# EAGLE design untitled (EAGLE 9.6.2)
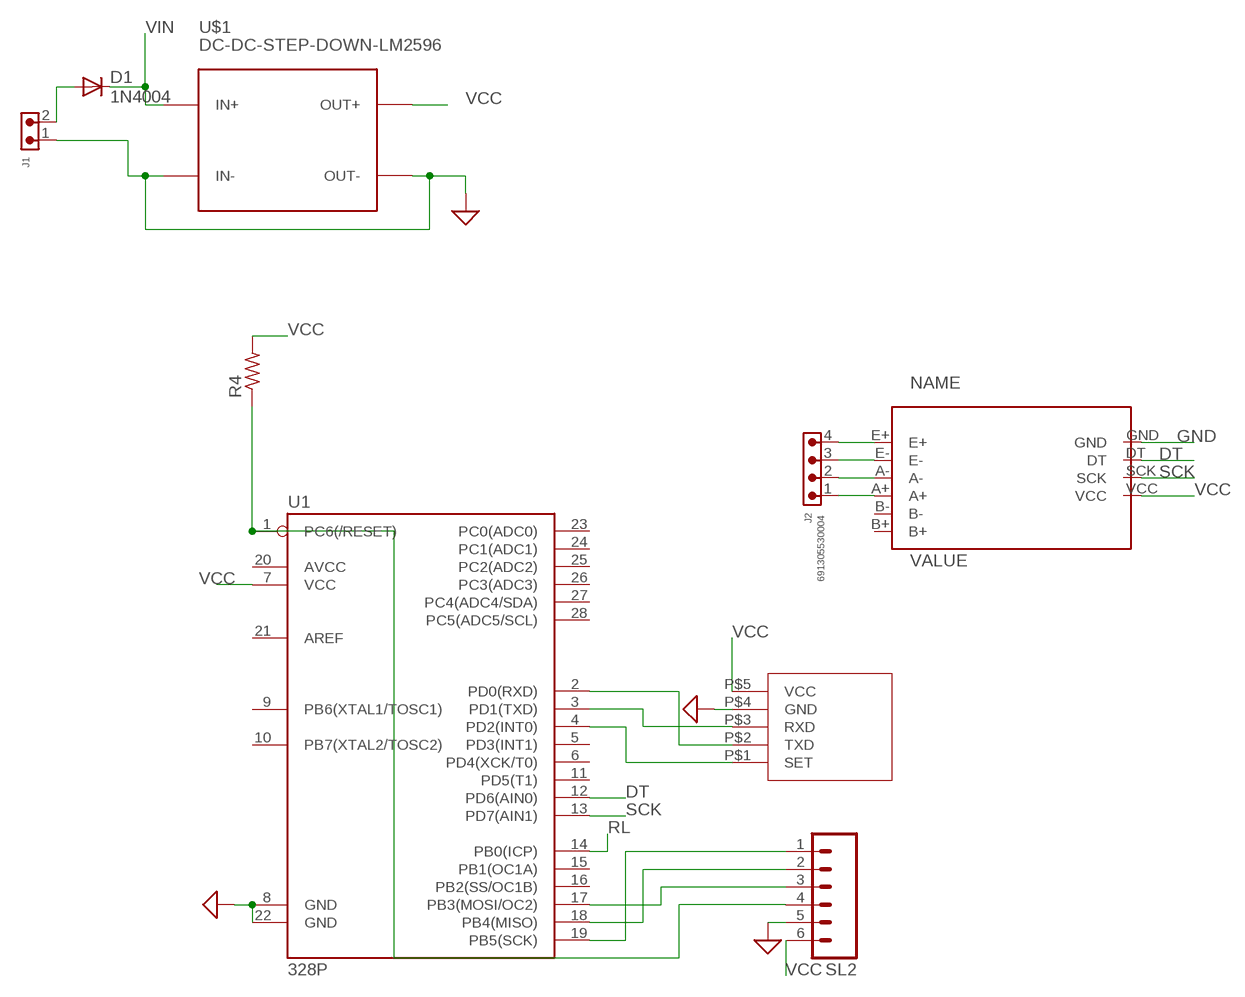
[diagram p0: schematic, sheet 1]

## Parts
D1  1N4004  [DO41-10]
J1  691305530002  691305530002  [691305530002]
J2  691305530004  691305530004  [691305530004]
R4  R-US_0207/7  [0207/7]
SL2  M06  [06P]
U1  328P  ATMEGA328P_PDIP  [DIP28]
U$1  DC-DC-STEP-DOWN-LM2596  [DC-DC-STEP-DOWN-LM2596]
U$2  HX711A  [HX711]
U$3  HC12  [HC12]

## Nets
DT: U1.12(PD6(AIN0)) U$2.DT
GND: J1.1 SL2.5 U1.8(GND) U1.22(GND) U$1.IN- U$1.OUT- U$2.GND U$3.P$4(GND) ; supply symbol labelled SUP
N$1: D1.A J1.2
N$2: J2.4 U$2.E+
N$3: U1.2(PD0(RXD)) U$3.P$2(TXD)
N$4: SL2.1 U1.19(PB5(SCK))
N$5: SL2.2 U1.18(PB4(MISO))
N$6: SL2.3 U1.17(PB3(MOSI/OC2))
N$7: U1.3(PD1(TXD)) U$3.P$3(RXD)
N$8: U1.4(PD2(INT0)) U$3.P$1(SET)
N$9: J2.3 U$2.E-
N$10: J2.2 U$2.A-
N$11: J2.1 U$2.A+
N$14: R4.1 SL2.4 U1.1(PC6(/RESET))
RL: U1.14(PB0(ICP))
SCK: U1.13(PD7(AIN1)) U$2.SCK
VCC: R4.2 SL2.6 U1.7(VCC) U$1.OUT+ U$2.VCC U$3.P$5(VCC)
VIN: D1.C U$1.IN+
Unconnected: U1.5(PD3(INT1)) U1.6(PD4(XCK/T0)) U1.9(PB6(XTAL1/TOSC1)) U1.10(PB7(XTAL2/TOSC2)) U1.11(PD5(T1)) U1.15(PB1(OC1A)) U1.16(PB2(SS/OC1B)) U1.20(AVCC) U1.21(AREF) U1.23(PC0(ADC0)) U1.24(PC1(ADC1)) U1.25(PC2(ADC2)) U1.26(PC3(ADC3)) U1.27(PC4(ADC4/SDA)) U1.28(PC5(ADC5/SCL)) U$2.B+ U$2.B-

## Library data of the parts
D1 = adafruit:1N4004: DIODE General purpose 1N400x type rectifier (With bigger pads) http://www.ladyada.net/library/pcb/eaglelibrary.html
J1 = Wurth_Connectors_WR-TBL Pluggable Connector:691305530002: WR-TBL Serie 3055 - 5,08 mm - PCB Header Vertical Entry with Plastic Latches KIND PROPERTIES Pitch 5.08 mm MATERIAL PROPERTIES Insulator Material PA66 Insulator Flammability Rating UL94 V-0 Insulator Color Green Terminal Material Copper Alloy Terminal Plating Tin-plated surface GENERAL INFORMATION Operating Temperature -40 up to +105 °C ELECTRICAL PROPERTIES IR UL 16 A Working Voltage [UL] 300 V (AC) Withstanding Voltage [UL] 2500 V (AC) Contact Resistance [UL] 20 mΩ CERTIFICATION UL Approval E315414 <https://www.we-online.com/catalog/media/o135349v209%20Family_WR-TBL3_6913055300xx.jpg> Details see: https://www.we-online.com/catalog/en/TBL_5_08_3055_6913055300XX/ Updated by Ella Wu 2019-12-30 2019(C) Wurth Elektronik; DATASHEET-URL: https://www.we-online.com/catalog/datasheet/691305530002.pdf; IR-UL: 16A; MOUNT: THT; PART-NUMBER: 691305530002; PINS: 2; PITCH: 5.08mm; TYPE: Vertical; WORKING-VOLTAGE-UL: 300V (AC)
J2 = Wurth_Connectors_WR-TBL Pluggable Connector:691305530004: WR-TBL Serie 3055 - 5,08 mm - PCB Header Vertical Entry with Plastic Latches KIND PROPERTIES Pitch 5.08 mm MATERIAL PROPERTIES Insulator Material PA66 Insulator Flammability Rating UL94 V-0 Insulator Color Green Terminal Material Copper Alloy Terminal Plating Tin-plated surface GENERAL INFORMATION Operating Temperature -40 up to +105 °C ELECTRICAL PROPERTIES IR UL 16 A Working Voltage [UL] 300 V (AC) Withstanding Voltage [UL] 2500 V (AC) Contact Resistance [UL] 20 mΩ CERTIFICATION UL Approval E315414 <https://www.we-online.com/catalog/media/o135349v209%20Family_WR-TBL3_6913055300xx.jpg> Details see: https://www.we-online.com/catalog/en/TBL_5_08_3055_6913055300XX/ Updated by Ella Wu 2019-12-30 2019(C) Wurth Elektronik; DATASHEET-URL: https://www.we-online.com/catalog/datasheet/691305530004.pdf; IR-UL: 16A; MOUNT: THT; PART-NUMBER: 691305530004; PINS: 4; PITCH: 5.08mm; TYPE: Vertical; WORKING-VOLTAGE-UL: 300V (AC)
R4 = adafruit:R-US_: RESISTOR, American symbol
SL2 = con-amp-quick:M06: AMP QUICK CONNECTOR; OC_FARNELL: unknown; OC_NEWARK: unknown
U1 = SparkFun-IC-Microcontroller:ATMEGA328P_PDIP: Atmel 328P Through hole ATMEGA328P uC used in the Arduino 32kb flash, 1k EEPROM, 2k SRAM Datasheet <http://www.sparkfun.com/datasheets/Components/SMD/ATMega328.pdf> SparkFun Products Storefront component: AVR 28 Pin 20MHz 32K 6A/D - ATMega328P <https://www.sparkfun.com/products/9061> (COM-09061) SparkFun Simon Says - Through-Hole Soldering Kit <https://www.sparkfun.com/products/10547> (KIT-10547) SparkFun Learn to Solder - Simon Says <https://www.sparkfun.com/products/13708> (KIT-13708) SparkFun BigTime Watch Kit <https://www.sparkfun.com/products/11734> (KIT-11734) SparkFun ClockIt <https://www.sparkfun.com/products/10930> (KIT-10930) SparkFun Serial Enabled LCD Kit <https://www.sparkfun.com/products/10097> (LCD-10097) SparkFun Simon Tilts - Through Hole Soldering Kit <https://www.sparkfun.com/products/12634> (KIT-12634) SparkFun Frequency Counter Kit <https://www.sparkfun.com/products/10140> (KIT-10140) FabFM Radio Kit <https://www.sparkfun.com/products/11043> (KIT-11043) SparkFun Binary Blaster Kit <https://www.sparkfun.com/products/12037> (KIT-12037) SparkFun Metro-Gnome <https://www.sparkfun.com/products/9236> (KIT-09236) ATmega328 with Arduino Optiboot (Uno) <https://www.sparkfun.com/products/10524> (DEV-10524); PROD_ID: IC-09136
U$1 = diy-modules:DC-DC-STEP-DOWN-LM2596: DC/DC Step-Down Regulator based on LM2596-ADJ chip LM2596 datasheet available here: http://www.ti.com/lit/ds/symlink/lm2596.pdf Click here to find device on ebay.com <http://www.ebay.com/sch/lm2596+power+regulator>
U$2 = HX711:HX711
U$3 = techart:HC12

## Board
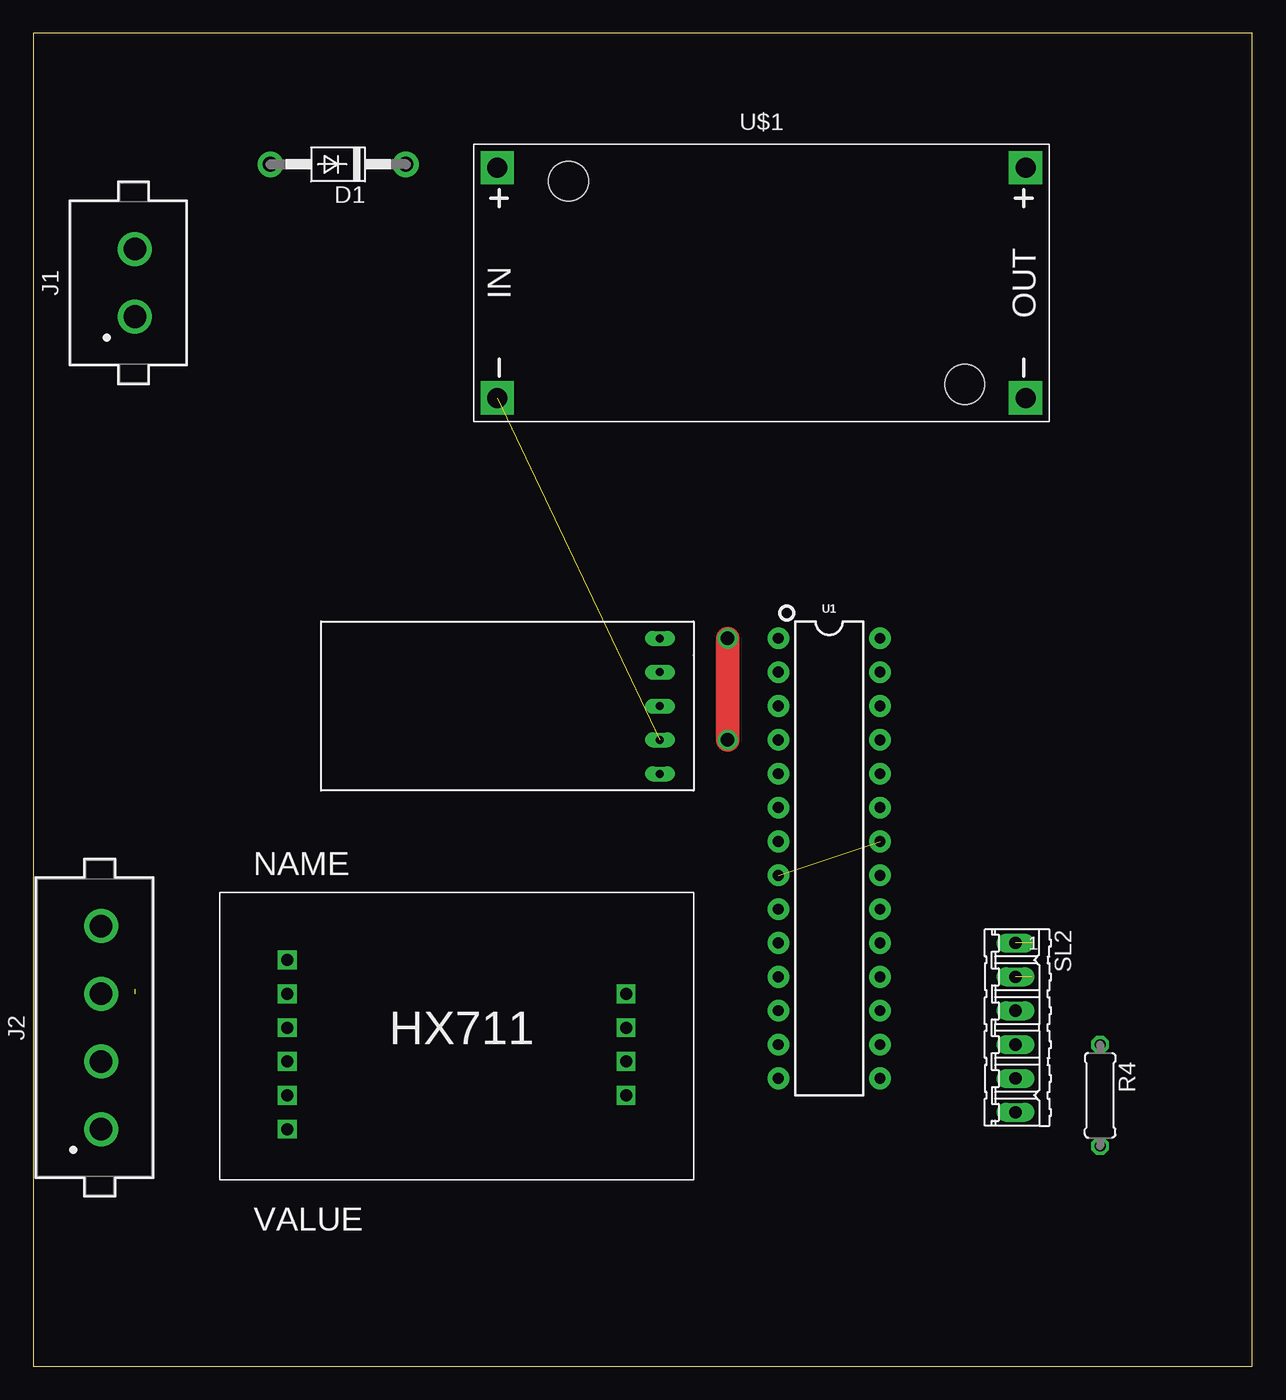
[diagram p1: board, top side]
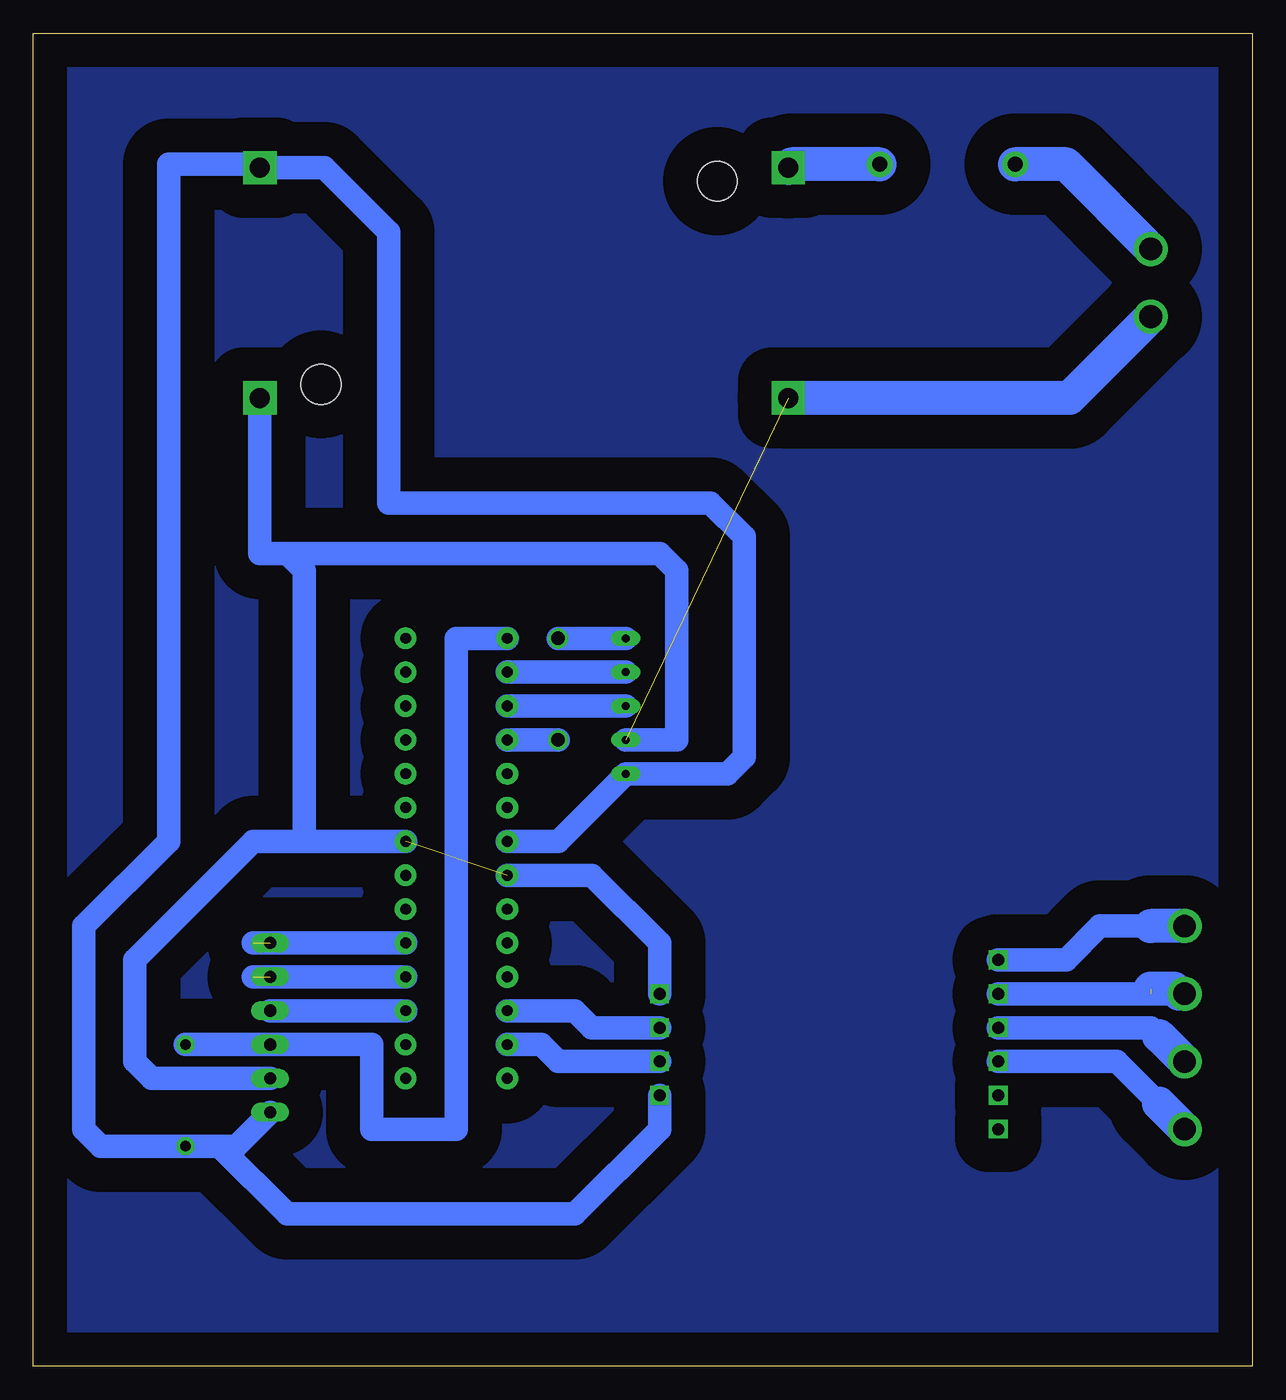
[diagram p2: board, bottom side, seen from below]

Size 91.42 x 100 mm. Coordinates in mm from the lower left corner, seen from the top.
Outline: 0,0 91.42,0 91.42,100 0,100 0,0
Copper layers (1*16): Top 0.035mm / dielectric 1.5mm / Bottom 0.035mm
Design rules "default *": minimum track width 6mil, minimum drill 0.35mm, track to track 30mil, track to pad 30mil, pad to pad 30mil, via to via 30mil, smd to smd 6mil, copper to edge 40mil, drill to drill 6mil, minimum pad ring 10mil, minimum via ring 8mil, stop-mask expansion 4mil, vias tented up to drill 0mil, thermal gap 10mil

### Footprints (pad centres in the part's own frame; a part is rotated, then mirrored left to right if it is on the bottom)
DO41-10 = drill 1.118 pad 1.93: A 5.08,0; C -5.08,0
691305530002 = drill 1.7: 1 -2.54,0; 2 2.54,0
691305530004 = drill 1.7: 1 -7.62,0; 2 -2.54,0; 3 2.54,0; 4 7.62,0
0207/7 = drill 0.813 octagon: 1 -3.81,0; 2 3.81,0
06P = drill 0.914 long: 1 -6.35,0; 2 -3.81,0; 3 -1.27,0; 4 1.27,0; 5 3.81,0; 6 6.35,0
DIP28 = drill 0.813 pad 1.626: 1 -16.51,-3.81; 2 -13.97,-3.81; 3 -11.43,-3.81; 4 -8.89,-3.81; 5 -6.35,-3.81; 6 -3.81,-3.81; 7 -1.27,-3.81; 8 1.27,-3.81; 9 3.81,-3.81; 10 6.35,-3.81; 11 8.89,-3.81; 12 11.43,-3.81; 13 13.97,-3.81; 14 16.51,-3.81; 15 16.51,3.81; 16 13.97,3.81; 17 11.43,3.81; 18 8.89,3.81; 19 6.35,3.81; 20 3.81,3.81; 21 1.27,3.81; 22 -1.27,3.81; 23 -3.81,3.81; 24 -6.35,3.81; 25 -8.89,3.81; 26 -11.43,3.81; 27 -13.97,3.81; 28 -16.51,3.81
DC-DC-STEP-DOWN-LM2596 = drill 1.5 pad 2.5 square: IN+ -19.812,8.636; IN- -19.812,-8.636; OUT+ 19.812,8.636; OUT- 19.812,-8.636 | hole 3: -14.478,7.62; 15.24,-7.62
HX711 = drill 0.9 square: A+ 8.89,21.59; A- 8.89,24.13; B+ 8.89,16.51; B- 8.89,19.05; DT 34.29,24.13; E+ 8.89,29.21; E- 8.89,26.67; GND 34.29,26.67; SCK 34.29,21.59; VCC 34.29,19.05
HC12 = drill 0.6 long: P$1 5.08,5.08; P$2 5.08,2.54; P$3 5.08,0; P$4 5.08,-2.54; P$5 5.08,-5.08

### Placement (x,y rotation side)
D1  22.86,90.17 180 top
J1  7.62,81.28 90 top
J2  5.08,25.4 90 top
R4  80.01,20.32 270 top
SL2  73.66,25.4 270 top
U1  59.69,38.1 270 top
U$1  54.61,81.28 0 top
U$2  10.16,1.27 0 top
U$3  41.91,49.53 0 top

### Tracks (layer width: path | path; a pad name or v marks a point on that pad's centre or on a via)
DT
  Bottom 1.778: U$2.DT 49.53,25.4 50.8,26.67 U1.12
GND  (2 unrouted)
  Bottom 1.778: U$3.P$4 43.18,46.99 43.18,59.69 44.45,60.96 72.39,60.96 | 72.39,60.96 74.42,60.96 U$1.OUT- | SL2.5 82.55,21.59 83.82,22.86 83.82,30.48 74.93,39.37 71.12,39.37 | 71.12,39.37 U1.22 | 71.12,39.37 71.12,59.69 72.39,60.96 | U$2.GND 44.45,31.75 49.53,36.83 U1.8
  Bottom 2.54: J1.1 13.72,72.64 U$1.IN-
N$1
  Bottom 2.54: J1.2 13.97,90.17 D1.A
N$2
  Bottom 1.778: 7.62,33.02 11.43,33.02 13.97,30.48 U$2.E+
  Bottom 2.54: J2.4 7.62,33.02
N$3
  Bottom 1.778: U$3.P$2 U1.2
N$4  (1 unrouted)
  Bottom 1.778: U1.19 74.93,31.75
N$5  (1 unrouted)
  Bottom 1.778: U1.18 74.93,29.21
N$6
  Bottom 1.778: U1.17 SL2.3
N$7
  Bottom 1.778: U1.3 U$3.P$3
N$8  (via drill 1)
  Top 1.778: v52.07,54.61 v52.07,46.99
  Bottom 1.778: U$3.P$1 v52.07,54.61 | v52.07,46.99 U1.4
N$9  (1 unrouted)
  Bottom 1.778: U$2.E- 7.62,27.94
  Bottom 2.54: J2.3 5.49,27.94 5.87,28.32 7.62,28.32
N$10
  Bottom 1.778: 6.99,24.77 7.62,25.4 U$2.A-
  Bottom 2.54: J2.2 6.99,24.77
N$11
  Bottom 1.778: 6.99,19.68 10.16,22.86 U$2.A+
  Bottom 2.54: J2.1 6.99,19.68
N$12
  pour Bottom (isolate 2.54): 0,100.33 91.44,100.33 91.44,0 0,0
N$14
  Bottom 1.778: U1.1 59.69,54.61 59.69,17.78 66.04,17.78 66.04,24.13 SL2.4 R4.1
SCK
  Bottom 1.778: U$2.SCK 52.07,22.86 53.34,24.13 U1.13
VCC
  Bottom 1.778: 77.47,16.51 76.2,16.51 SL2.6 | 77.47,16.51 R4.2 86.36,16.51 87.63,17.78 87.63,33.02 81.28,39.37 81.28,90.17 74.68,90.17 U$1.OUT+ 69.6,89.92 64.77,85.09 64.77,64.77 40.64,64.77 38.1,62.23 38.1,45.72 39.37,44.45 U$3.P$5 52.07,39.37 U1.7 | U$2.VCC 44.45,17.78 50.8,11.43 72.39,11.43 77.47,16.51
VIN
  Bottom 2.54: D1.C 34.54,90.17 U$1.IN+